# Altium schematic sheet ARDUINO UNO_2021-11-30.schdoc
size 95 x 83 mm
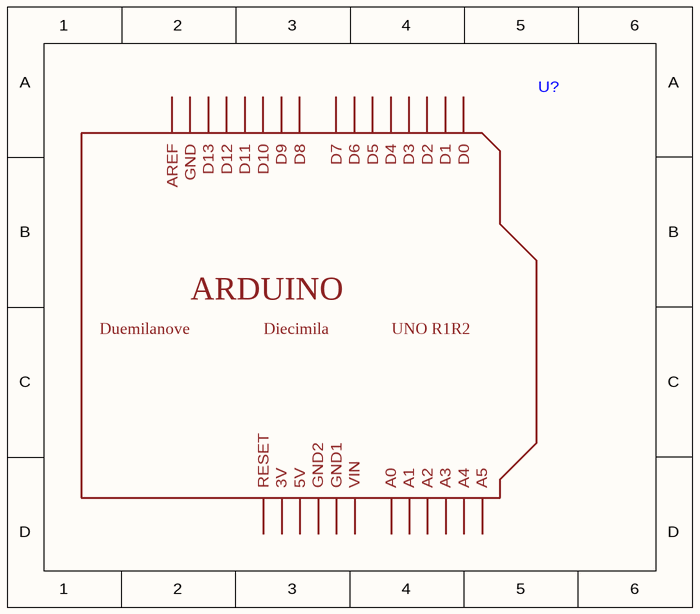
[diagram p0: ARDUINO UNO_2021-11-30.schdoc]

## Parts
U?  (no value)  [ARDUINO-UNO]

## Nets

Not connected (* = marked no-connect by the designer): U? 3V 5V A0 A1 A2 A3 A4 A5 AREF D0 D1 D2 D3 D4 D5 D6 D7 D8 D9 D10 D11 D12 D13 GND GND1 GND2 RESET VIN

## Notes on the sheet
- (in symbol ARDUINO UNO) ARDUINO; Duemilanove; Diecimila; UNO R1R2

## Library data of the parts
U? = ARDUINO UNO